# EasyEDA schematic SCH_Teensy CNC v2_2023-01-18.json
TITLE: Sheet_1; REV: 1.0; Date: 2022-09-19; Sheet: 1/1; Drawn By: Willy Schütze; Company: Your Company
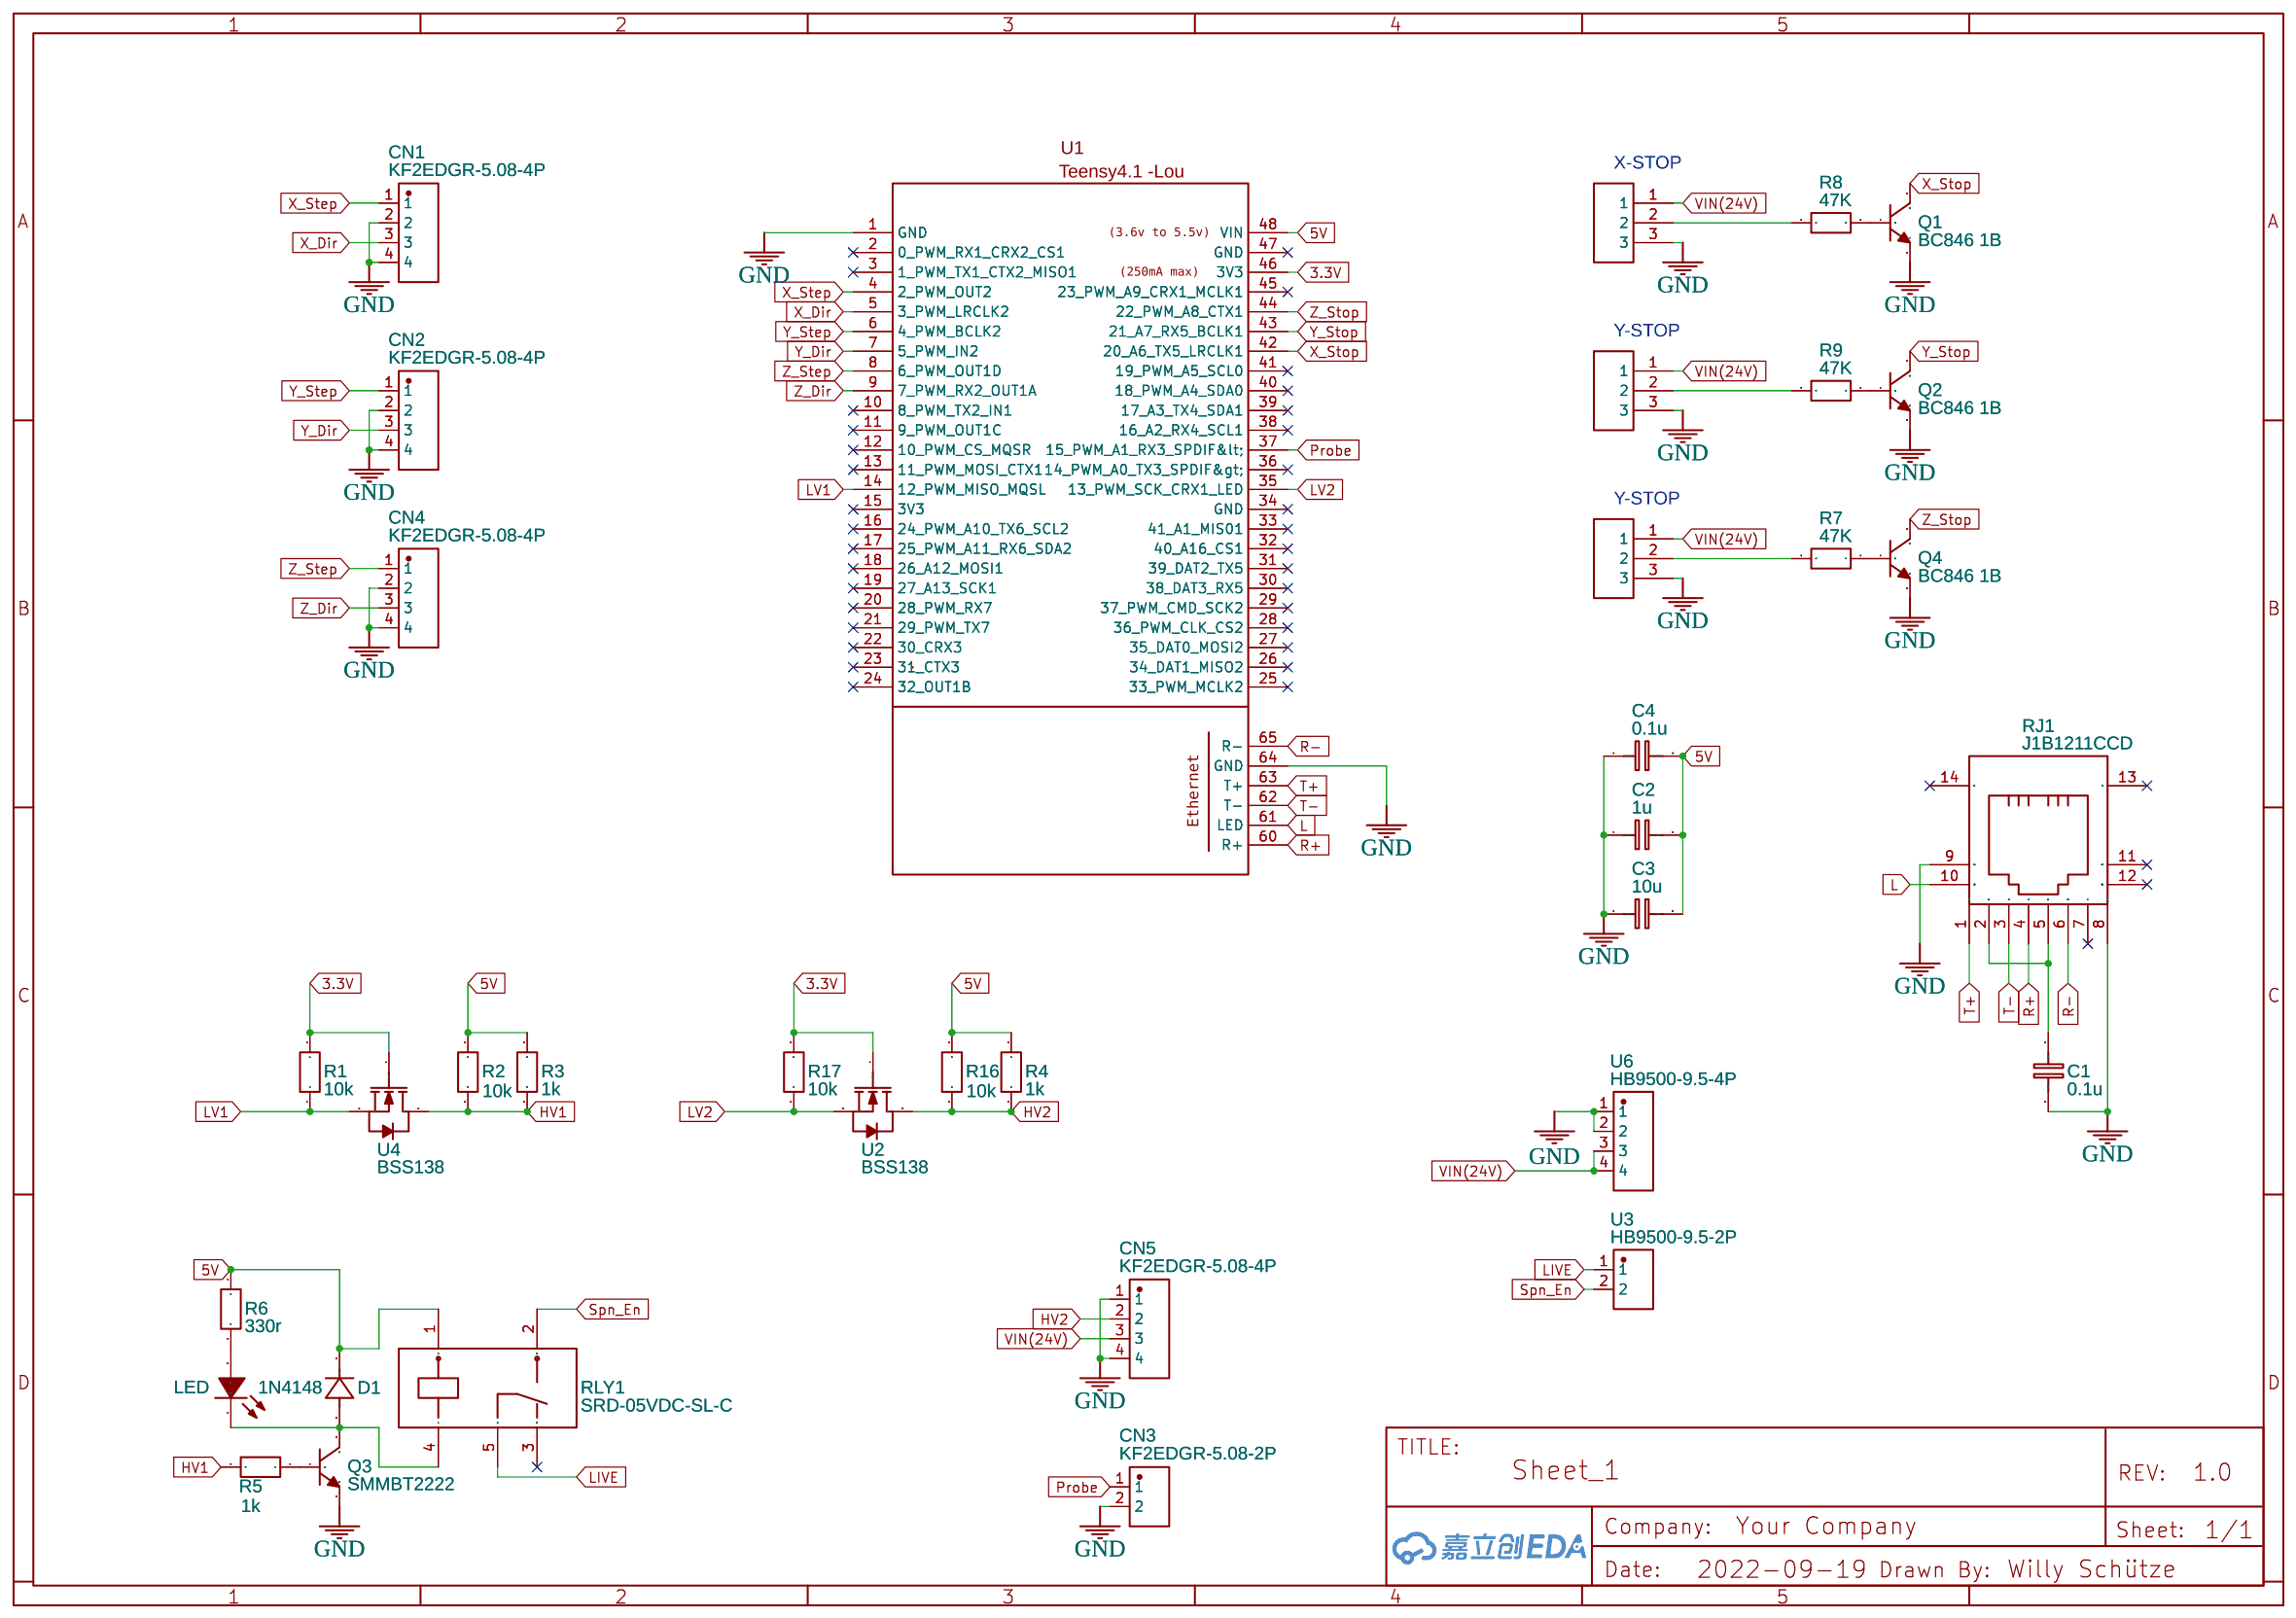
[diagram p0: schematic sheet]

## Parts
C1  0.1u  [C1206]
C2  1u  [C1206]
C3  10u  [C1206]
C4  0.1u  [C1206]
CN1  KF2EDGR-5.08-4P  [CONN-TH_4P-P5.08_KF2EDGR-5.08-4P]
CN2  KF2EDGR-5.08-4P  [CONN-TH_4P-P5.08_KF2EDGR-5.08-4P]
CN3  KF2EDGR-5.08-2P  [CONN-TH_2P-P5.08_KF2EDGR-5.08-2P]
CN4  KF2EDGR-5.08-4P  [CONN-TH_4P-P5.08_KF2EDGR-5.08-4P]
CN5  KF2EDGR-5.08-4P  [CONN-TH_4P-P5.08_KF2EDGR-5.08-4P]
D1  1N4148  [SOD-123_L2.6-W1.6-LS3.5-RD]
LED  1206 LED Fab Lab UCAL  [LED 1206]
Q1  BC846 1B  [SOT-23-3_L2.9-W1.6-P1.90-LS2.8-BR]
Q2  BC846 1B  [SOT-23-3_L2.9-W1.6-P1.90-LS2.8-BR]
Q3  SMMBT2222  [SOT-23-3_L2.9-W1.3-P1.90-LS2.4-BR]
Q4  BC846 1B  [SOT-23-3_L2.9-W1.6-P1.90-LS2.8-BR]
R1  10k  [R1206]
R2  10k  [R1206]
R3  1k  [R1206]
R4  1k  [R1206]
R5  1k  [R1206]
R6  330r  [R1206]
R7  47K  [R1206]
R8  47K  [R1206]
R9  47K  [R1206]
R16  10k  [R1206]
R17  10k  [R1206]
RJ1  J1B1211CCD  [RJ45-TH_J1B1211CCD]
RLY1  SRD-05VDC-SL-C  [RELAY-TH_SRD-XXVDC-XL-C]
U1  JST-XH-03  [JST-XH-03-PACKAGE-LONG-PAD]
U2  BSS138  [SOT-23-3_L2.9-W1.3-P1.90-LS2.6-BR]
U3  HB9500-9.5-2P  [CONN-TH_HB9500-9.5-2P]
U4  BSS138  [SOT-23-3_L2.9-W1.3-P1.90-LS2.6-BR]
U5  Teensy4.1 - WS3  [TEENSY4.1 - WS3]
U6  HB9500-9.5-4P  [CONN-TH_HB9500-9.5-4P]
U8  JST-XH-03  [JST-XH-03-PACKAGE-LONG-PAD]
U9  JST-XH-03  [JST-XH-03-PACKAGE-LONG-PAD]

## Library data of the parts
C1-C4 = C_1206_EU: Contributor: LCEDA_Lib
CN1 CN2 CN4 CN5 = KF2EDGR-5.08-4P: Supplier: LCSC; Supplier Part: C441206; Manufacturer: Cixi Kefa Elec; Contributor: LCSC; JLCPCB Part Class: Extended Part
CN3 = KF2EDGR-5.08-2P: Supplier: LCSC; Supplier Part: C441204; Manufacturer: Cixi Kefa Elec; Contributor: LCSC; JLCPCB Part Class: Extended Part
D1 = 1N4148SOD-123: Supplier: LCSC; Supplier Part: C2972760; Manufacturer: JKSEMI(金开盛); Contributor: lcsc; JLCPCB Part Class: Extended Part
LED = 1206 LED Fab Lab UCAL: Supplier Part: 1206; Supplier: LCSC; Manufacturer: KENTO; Manufacturer Part: 1206 LED; image: //image.lceda.cn/szlcsc/C49018.jpg; Contributor: Willy Schütze
Q1 Q2 Q4 = BC846 1B: Supplier: LCSC; Manufacturer: CJ; Supplier Part: C8573; JLCPCB Part Class: Extended Part
Q3 = SMMBT2222ALT1G: Supplier: LCSC; Supplier Part: C604704; Manufacturer: onsemi(安森美); Contributor: LCSC; JLCPCB Part Class: Extended Part
R1-R9 R16 R17 = R_1206_EU: Contributor: LCEDA_Lib
RJ1 = J1B1211CCD: Supplier: LCSC; Supplier Part: C910371; Manufacturer: WIZNET; Contributor: LCSC; JLCPCB Part Class: Extended Part
RLY1 = SRD-05VDC-SL-C: Supplier: LCSC; Manufacturer: 松乐; Supplier Part: C35449; JLCPCB Part Class: Extended Part
U1 U8 U9 = JST-XH-03: Contributor: TheSkunk
U2 U4 = BSS138LT7G: Supplier: LCSC; Supplier Part: C894772; Manufacturer: onsemi(安森美); link: https://atta.szlcsc.comnull; Contributor: lcsc
U3 = HB9500-9.5-2P: Supplier: LCSC; Supplier Part: C707836; Manufacturer: Cixi Kefa Elec; Contributor: LCSC; JLCPCB Part Class: Extended Part
U5 = Teensy4.1 - WS3: Manufacturer: PJRC; Manufacturer Part: Teensy4.1; link: https://www.pjrc.com/store/teensy41.html; Contributor: Willy Schütze
U6 = HB9500-9.5-4P: Supplier: LCSC; Supplier Part: C707838; Manufacturer: Cixi Kefa Elec; Contributor: LCSC; JLCPCB Part Class: Extended Part

## Nets
3.3V: R1.2 R17.2 U2.1(G) U4.1(G) U5.46(3V3)
5V: C2.2 C3.2 C4.2 D1.1(K) R2.2 R3.2 R4.2 R6.1 R16.2 RLY1.1 U5.48(VIN)
GND: C1.2 C2.1 C3.1 C4.1 CN1.2 CN1.4 CN2.2 CN2.4 CN3.2 CN4.2 CN4.4 CN5.1 CN5.4 Q1.2(E) Q2.2(E) Q3.2(E) Q4.2(E) RJ1.8 RJ1.9(LLED-) U1.3 U5.1(GND) U5.64(GND) U6.1 U6.2 U8.3 U9.3
VIN(24V): CN5.3 U1.1 U6.3 U6.4 U8.1 U9.1
HV1: R2.1 R3.1 R5.2 U4.3(D)
HV2: CN5.2 R4.1 R16.1 U2.3(D)
L: RJ1.10(LLED+) U5.61(LED)
LIVE: RLY1.5 U3.1
LV1: R1.1 U4.2(S) U5.14(12_PWM_MISO_MQSL)
LV2: R17.1 U2.2(S) U5.35(13_PWM_SCK_CRX1_LED)
Probe: CN3.1 U5.37(15_PWM_A1_RX3_SPDIF<)
R+: RJ1.4 U5.60(R+)
R-: RJ1.6 U5.65(R-)
Spn_En: RLY1.2 U3.2
T+: RJ1.1 U5.63(T+)
T-: RJ1.3 U5.62(T-)
X_Dir: CN1.3 U5.5(3_PWM_LRCLK2)
X_Step: CN1.1 U5.4(2_PWM_OUT2)
X_Stop: Q1.3(C) U5.42(20_A6_TX5_LRCLK1)
Y_Dir: CN2.3 U5.7(5_PWM_IN2)
Y_Step: CN2.1 U5.6(4_PWM_BCLK2)
Y_Stop: Q2.3(C) U5.43(21_A7_RX5_BCLK1)
Z_Dir: CN4.3 U5.9(7_PWM_RX2_OUT1A)
Z_Step: CN4.1 U5.8(6_PWM_OUT1D)
Z_Stop: Q4.3(C) U5.44(22_PWM_A8_CTX1)
Net-(C1-1): C1.1 RJ1.2 RJ1.5
Net-(D1-2): D1.2(A) LED.1(K) Q3.3(C) RLY1.4
Net-(LED-2): LED.2(A) R6.2
Net-(Q1-1): Q1.1(B) R8.1
Net-(Q2-1): Q2.1(B) R9.1
Net-(Q3-1): Q3.1(B) R5.1
Net-(Q4-1): Q4.1(B) R7.1
Net-(R7-2): R7.2 U1.2
Net-(R8-2): R8.2 U9.2
Net-(R9-2): R9.2 U8.2

Not connected (* = marked no-connect by the designer): RJ1 7* 11(RLED-)* 12(RLED+)* 13(GND)* 14(GND)*; RLY1 3*; U5 2(0_PWM_RX1_CRX2_CS1)* 3(1_PWM_TX1_CTX2_MISO1)* 10(8_PWM_TX2_IN1)* 11(9_PWM_OUT1C)* 12(10_PWM_CS_MQSR)* 13(11_PWM_MOSI_CTX1)* 15(3V3)* 16(24_PWM_A10_TX6_SCL2)* 17(25_PWM_A11_RX6_SDA2)* 18(26_A12_MOSI1)* 19(27_A13_SCK1)* 20(28_PWM_RX7)* 21(29_PWM_TX7)* 22(30_CRX3)* 23(31_CTX3)* 24(32_OUT1B)* 25(33_PWM_MCLK2)* 26(34_DAT1_MISO2)* 27(35_DAT0_MOSI2)* 28(36_PWM_CLK_CS2)* 29(37_PWM_CMD_SCK2)* 30(38_DAT3_RX5)* 31(39_DAT2_TX5)* 32(40_A16_CS1)* 33(41_A1_MIS01)* 34(GND)* 36(14_PWM_A0_TX3_SPDIF>)* 38(16_A2_RX4_SCL1)* 39(17_A3_TX4_SDA1)* 40(18_PWM_A4_SDA0)* 41(19_PWM_A5_SCL0)* 45(23_PWM_A9_CRX1_MCLK1)* 47(GND)*

## Notes on the sheet
- X-STOP
- Y-STOP
- Y-STOP
